# Altium schematic sheet TempSense.SchDoc
size Letter; Author: Adam Gilbert; CompanyName: McGill University; DrawnBy: Adam Gilbert; Organization: Altium Limited; Address1: McGill Cosmology; Address2: 3600 University Street; Address3: Montreal, Quebec; Address4: Canada; DocumentNumber: 10; Revision: Rev2; SheetNumber: 10; SheetTotal: 16; ProjectTitle: DfMux FMC Mezz; ModelNumber: MGMEZZ04; ProjectName: DfMux FMC Mezz
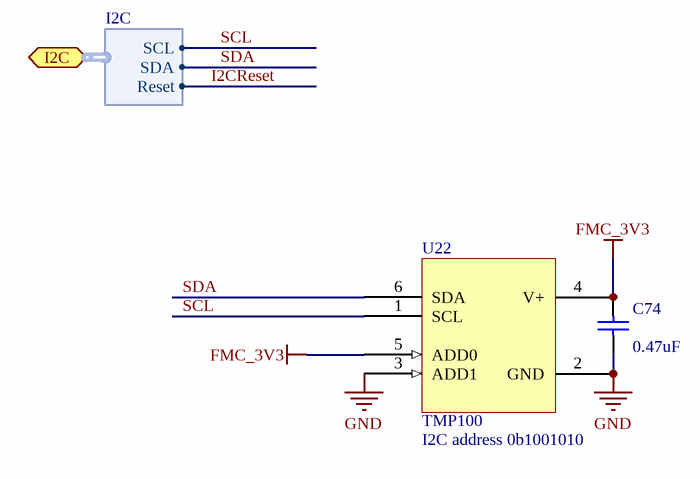
[diagram p0: TempSense.SchDoc]

## Parts
C74  0.47uF  [0402]
U22  TMP100  [SOT23-6]

## Ports
I2C (harness I2C)

## Harnesses
I2C: SCL, SDA, Reset

## Nets
FMC_3V3: C74.2 U22.4(V+) U22.5(ADD0)
GND: C74.1 U22.2(GND) U22.3(ADD1)
I2CReset: port I2C.Reset
SCL: U22.1(SCL) ; port I2C.SCL
SDA: U22.6(SDA) ; port I2C.SDA

## Notes on the sheet
- (near U22) I2C address 0b1001010
- File:
- Size:
- Date:
- Letter
- Revision:
- Sheet
- of
- Cosmology
- Drawn by:

## Library data of the parts
C74 = Cap Semi: Capacitor (Semiconductor SIM Model); Manufacturer: e.g Taiyo Yuden; Part constraints: 0.47uF, 6.3V, 10%, X5R, 0402; Manufacturer Part Number 1: e.g JMK105BJ474KV-F; Assembly Comments: none; Value: 0.47uF; Supplier 1: Digikey; Supplier Part Number 1: 587-1230-1-ND
U22 = TMP100: Digital Temperature Sensor with I2C Interface; Part Constraints: TMP100NA; Manufacturer: Texas Instruments; Manufacturer Part Number 1: TMP100NA/3K; Assembly Comments: none; Operating Temperature: -55°C ~ 125°C; Packaging: Cut Tape (CT); Supplier 1: Digi-Key; Supplier Part Number 1: 296-26833-1-ND